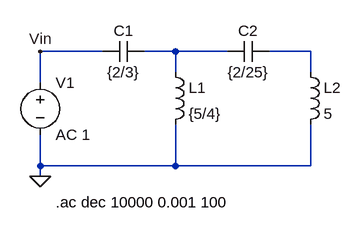
[diagram p0: schematic punto1d.asc]
punto1d.asc, the LTspice schematic file:
Version 4
SHEET 1 1000 760
WIRE 160 96 64 96
WIRE 272 96 224 96
WIRE 352 96 272 96
WIRE 480 96 416 96
WIRE 272 128 272 96
WIRE 480 128 480 96
WIRE 64 144 64 96
WIRE 64 272 64 224
WIRE 272 272 272 208
WIRE 272 272 64 272
WIRE 480 272 480 208
WIRE 480 272 272 272
WIRE 64 288 64 272
FLAG 64 288 0
FLAG 64 96 Vin
SYMBOL voltage 64 128 R0
SYMATTR InstName V1
SYMATTR Value AC 1
SYMBOL cap 224 80 R90
WINDOW 0 0 32 VBottom 2
WINDOW 3 32 32 VTop 2
SYMATTR InstName C1
SYMATTR Value {2/3}
SYMBOL cap 416 80 R90
WINDOW 0 0 32 VBottom 2
WINDOW 3 32 32 VTop 2
SYMATTR InstName C2
SYMATTR Value {2/25}
SYMBOL ind 256 112 R0
SYMATTR InstName L1
SYMATTR Value {5/4}
SYMATTR SpiceLine Rser=0 Rpar=1e30
SYMBOL ind 464 112 R0
SYMATTR InstName L2
SYMATTR Value 5
SYMATTR SpiceLine Rser=0 Rpar=1e30
TEXT 88 328 Left 2 !.ac dec 10000 0.001 100

The netlist it stands for:
* punto1d.asc
V1 Vin 0 AC 1
C1 N001 Vin {2/3}
C2 N002 N001 {2/25}
L1 N001 0 {5/4} Rser=0 Rpar=1e30
L2 N002 0 5 Rser=0 Rpar=1e30
.ac dec 10000 0.001 100
.backanno
.end